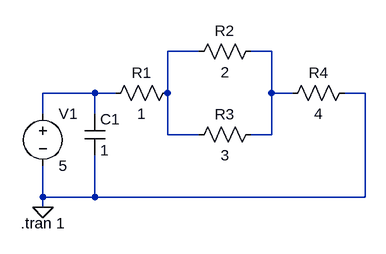
[diagram p0: schematic more_complicated_net.asc]
more_complicated_net.asc, the LTspice schematic file:
Version 4
SHEET 1 880 680
WIRE 288 16 240 16
WIRE 400 16 368 16
WIRE 128 80 48 80
WIRE 160 80 128 80
WIRE 240 80 240 16
WIRE 400 80 400 16
WIRE 432 80 400 80
WIRE 544 80 512 80
WIRE 48 112 48 80
WIRE 128 112 128 80
WIRE 240 144 240 80
WIRE 288 144 240 144
WIRE 400 144 400 80
WIRE 400 144 368 144
WIRE 48 240 48 192
WIRE 128 240 128 176
WIRE 128 240 48 240
WIRE 544 240 544 80
WIRE 544 240 128 240
WIRE 48 256 48 240
FLAG 48 256 0
SYMBOL voltage 48 96 R0
WINDOW 123 0 0 Left 0
WINDOW 39 0 0 Left 0
SYMATTR InstName V1
SYMATTR Value 5
SYMBOL res 256 64 R90
WINDOW 0 0 56 VBottom 2
WINDOW 3 32 56 VTop 2
SYMATTR InstName R1
SYMATTR Value 1
SYMBOL res 384 0 R90
WINDOW 0 0 56 VBottom 2
WINDOW 3 32 56 VTop 2
SYMATTR InstName R2
SYMATTR Value 2
SYMBOL res 384 128 R90
WINDOW 0 0 56 VBottom 2
WINDOW 3 32 56 VTop 2
SYMATTR InstName R3
SYMATTR Value 3
SYMBOL res 528 64 R90
WINDOW 0 0 56 VBottom 2
WINDOW 3 32 56 VTop 2
SYMATTR InstName R4
SYMATTR Value 4
SYMBOL cap 112 112 R0
SYMATTR InstName C1
SYMATTR Value 1
TEXT 14 280 Left 2 !.tran 1

The netlist it stands for:
* more_complicated_net.asc
V1 N003 0 5
R1 N001 N003 1
R2 N002 N001 2
R3 N002 N001 3
R4 0 N002 4
C1 N003 0 1
.tran 1
.backanno
.end